# EAGLE design cloud_sensor (EAGLE 6.4)
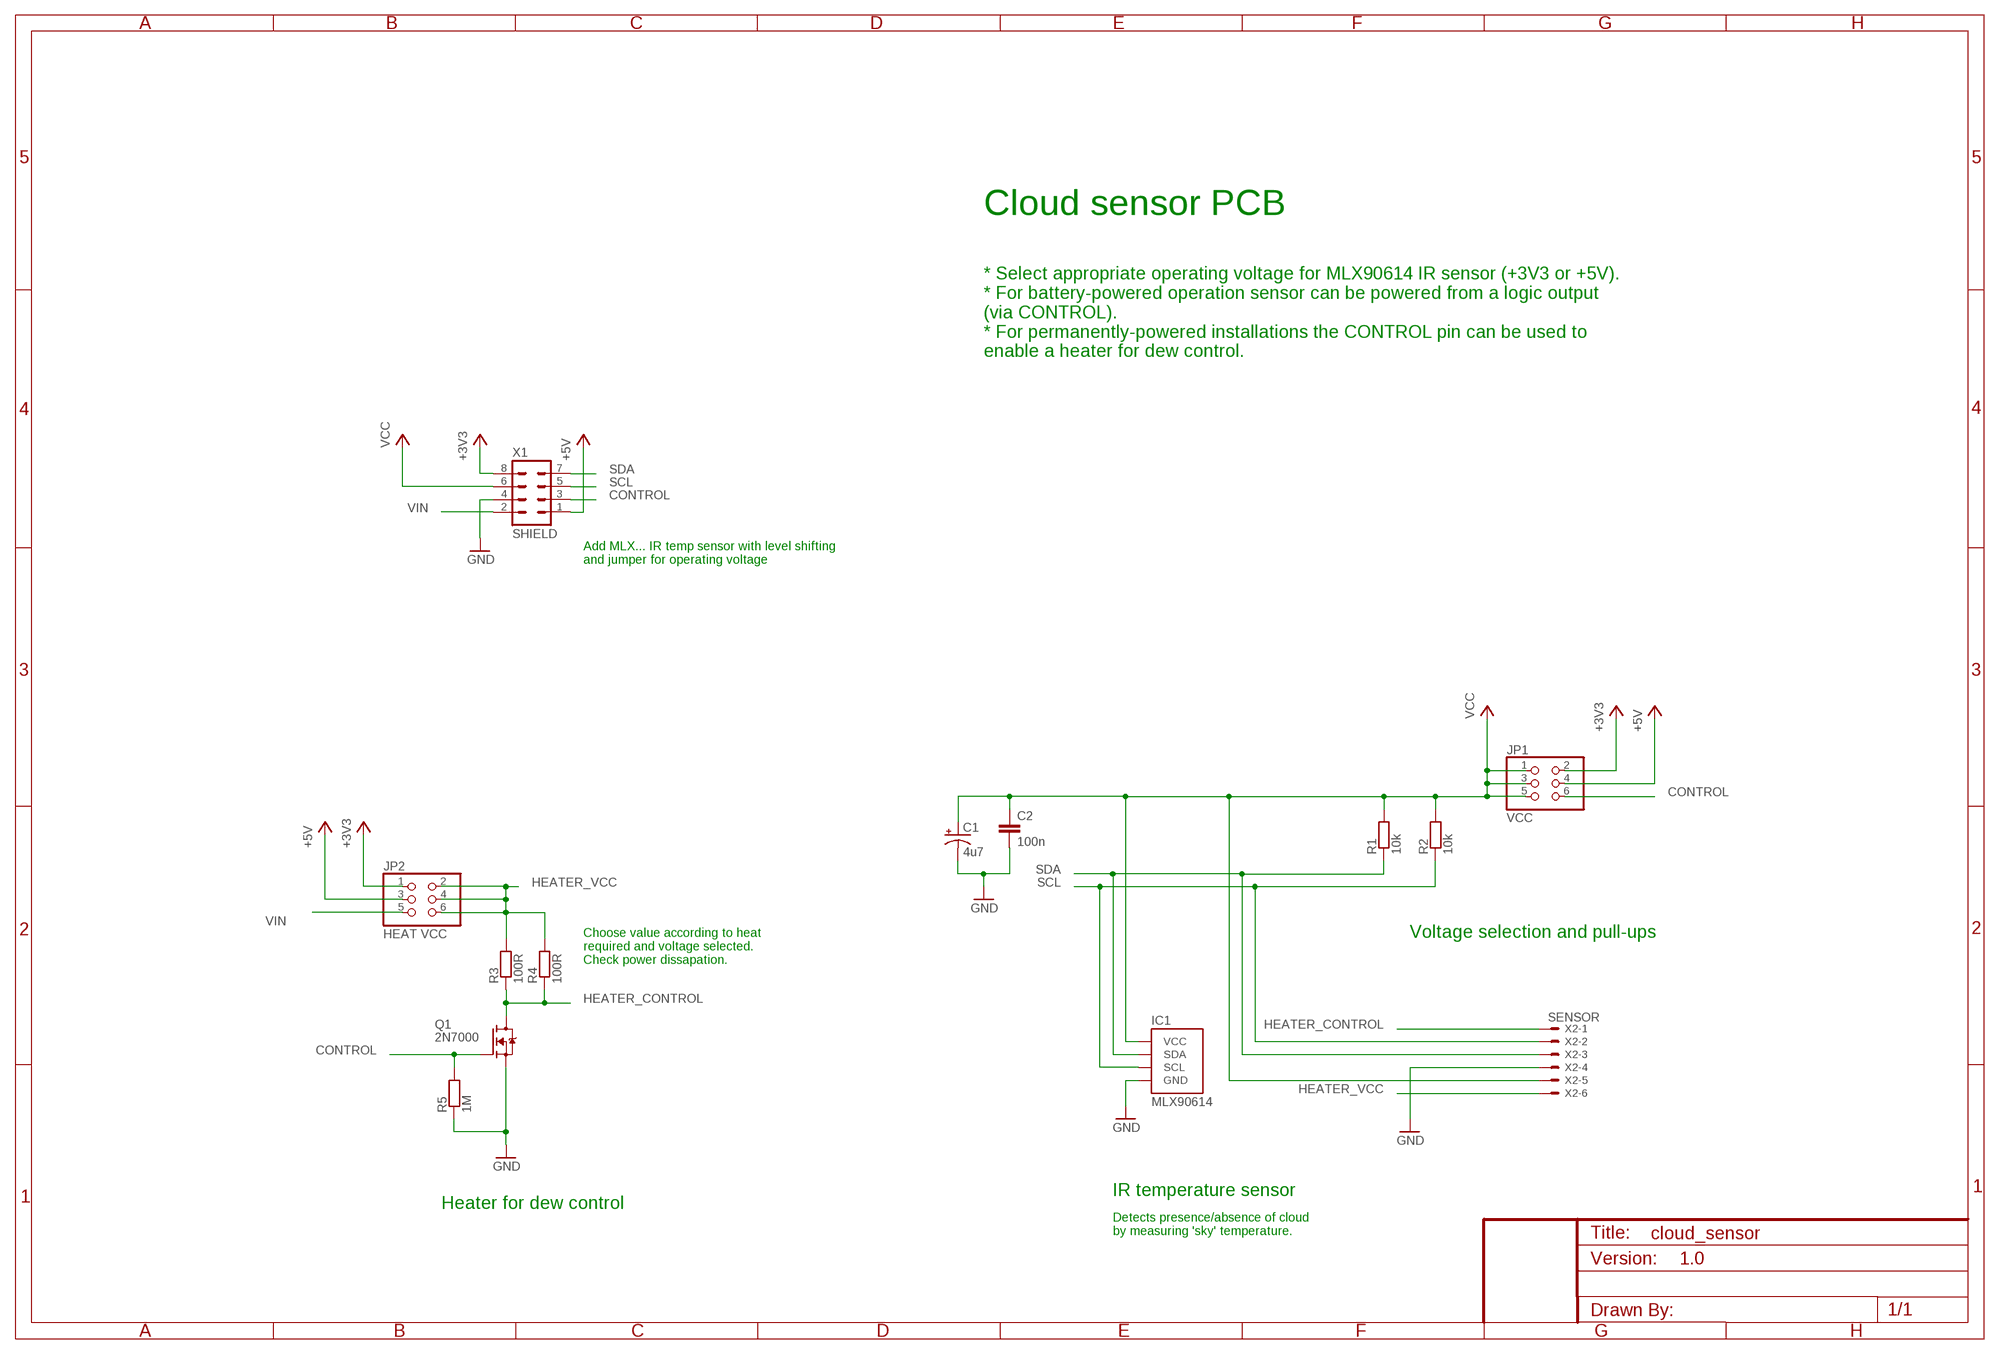
[diagram p0: schematic, sheet 1]

## Parts
C1  4u7  CAP_POLPTH2  [CPOL-RADIAL-10UF-25V]
C2  100n  CAPPTH  [CAP-PTH-SMALL]
IC1  MLX90614  MLX90614TO-39  [TO39-4]
JP1  VCC  PINHD-2X3  [2X03]
JP2  HEAT VCC  PINHD-2X3  [2X03]
Q1  2N7000  [TO-92]
R1  10k  RESISTOR  [RES-AXIAL-0.4]
R2  10k  RESISTOR  [RES-AXIAL-0.4]
R3  100R  RESISTOR  [RES-AXIAL-0.4]
R4  100R  RESISTOR  [RES-AXIAL-0.4]
R5  1M  RESISTOR  [RES-AXIAL-0.4]
X1  SHIELD  ML8  [ML8]
X2  SENSOR  22-23-2061  [22-23-2061]

## Nets
+3V3 [power]: JP1.2 JP2.1 X1.8
+5V [power]: JP1.4 JP2.3 X1.1
CONTROL: JP1.6 Q1.2(G) R5.P$2 X1.3
GND [power]: C1.2(-) C2.2 IC1.4(GND) Q1.1(S) R5.P$1 X1.4 X2.4
HEATER_CONTROL [power]: Q1.3(D) R3.P$1 R4.P$1 X2.1
HEATER_VCC [power]: JP2.2 JP2.4 JP2.6 R3.P$2 R4.P$2 X2.6
SCL: IC1.1(SCL) R2.P$1 X1.5 X2.2
SDA: IC1.2(SDA) R1.P$1 X1.7 X2.3
VCC [power]: C1.1(+) C2.1 IC1.3(VCC) JP1.1 JP1.3 JP1.5 R1.P$2 R2.P$2 X1.6 X2.5
VIN [power]: JP2.5 X1.2

## Notes on the sheet
- Cloud sensor PCB
- * Select appropriate operating voltage for MLX90614 IR sensor (+3V3 or +5V).
  * For battery-powered operation sensor can be powered from a logic output
  (via CONTROL).
  * For permanently-powered installations the CONTROL pin can be used to
  enable a heater for dew control.
- Add MLX... IR temp sensor with level shifting
  and jumper for operating voltage
- Voltage selection and pull-ups
- Choose value according to heat
  required and voltage selected.
  Check power dissapation.
- IR temperature sensor
- Heater for dew control
- Detects presence/absence of cloud
  by measuring 'sky' temperature.
- 1.0

## Library data of the parts
C1 = SteveMarple:CAP_POL: Capacitor Polarized These are standard SMD and PTH capacitors. Normally 10uF, 47uF, and 100uF in electrolytic and tantalum varieties. Always verify the external diameter of the through hole cap, it varies with capacity, voltage, and manufacturer. The EIA devices should be standard.
C2 = SparkFun:CAP: Capacitor Standard 0603 ceramic capacitor, and 0.1" leaded capacitor.
IC1 = SteveMarple:MLX90614
JP1 JP2 = pinhead:PINHD-2X3: PIN HEADER
Q1 = SteveMarple:2N7000: 2N7000 FET
R1-R5 = SteveMarple:RESISTOR: 1/4W PTH resistor
X1 = SteveMarple:ML8
X2 = con-molex:22-23-2061: .100" (2.54mm) Center Header - 6 Pin; MF: MOLEX; MPN: 22-23-2061; OC_FARNELL: 1462922; OC_NEWARK: 27C1933

## Net classes
1 power: width 0.381 mm

## Board
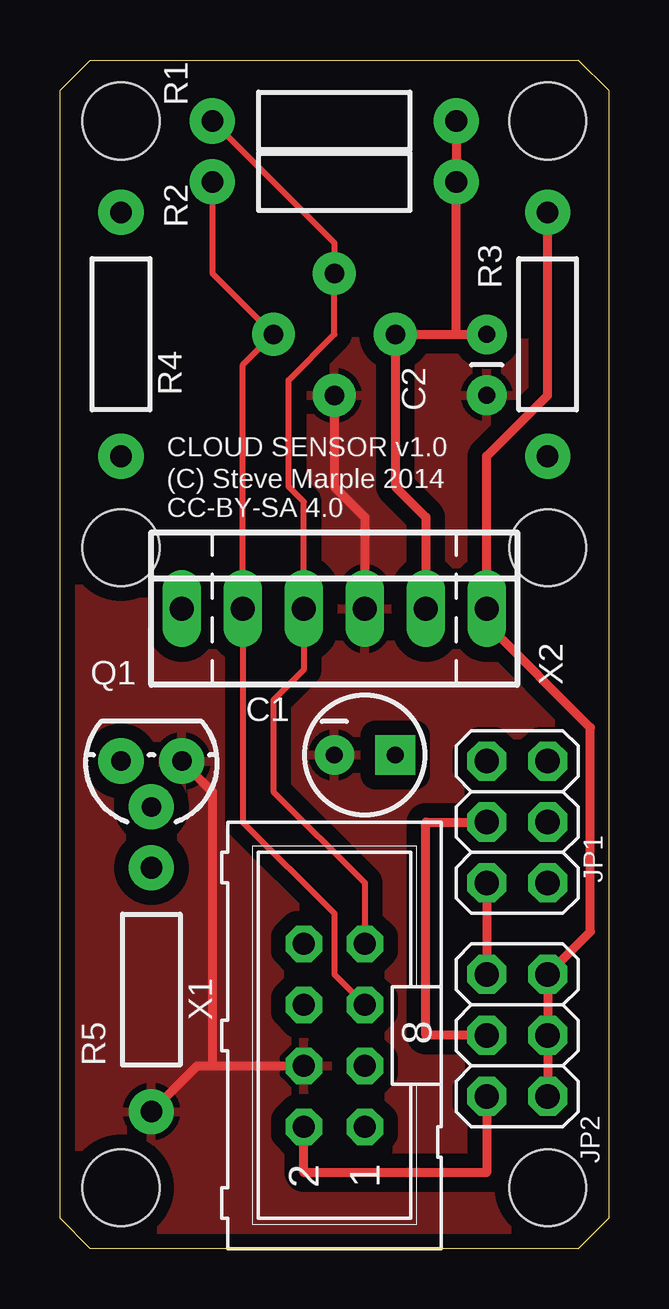
[diagram p1: board, top side]
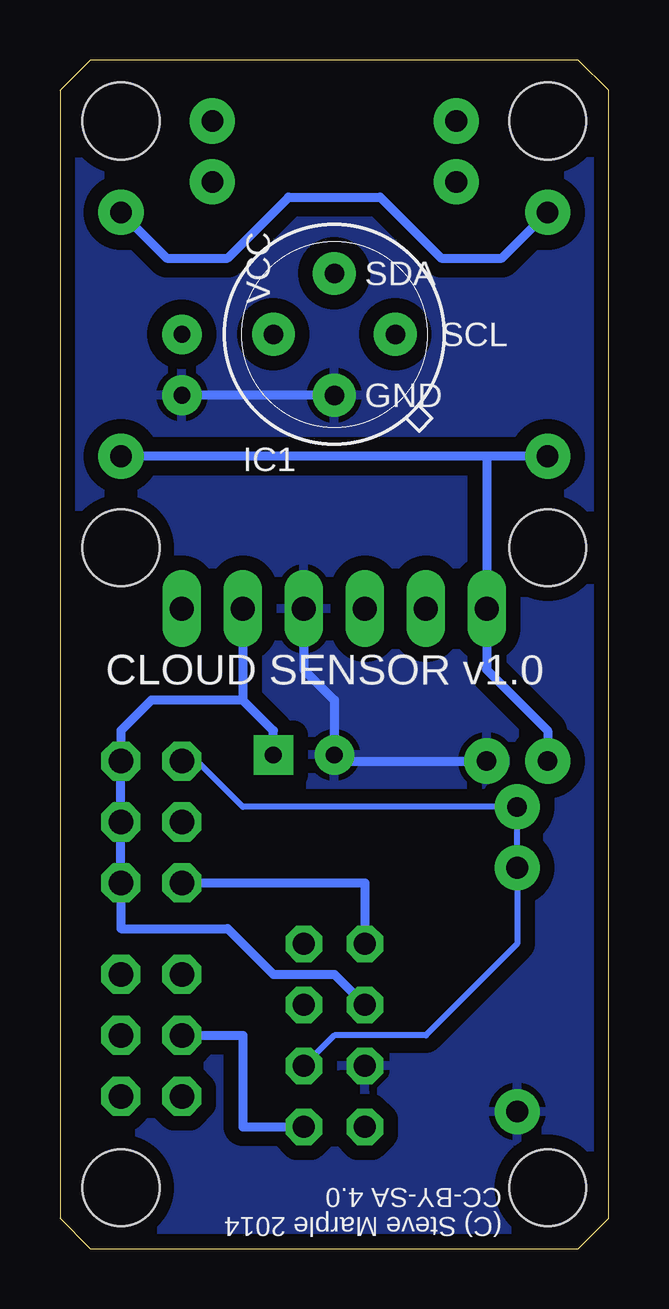
[diagram p2: board, bottom side, seen from below]

Size 22.86 x 49.53 mm. Coordinates in mm from the lower left corner, seen from the top.
Outline: 0,1.27 0,48.26 1.27,49.53 21.59,49.53 22.86,48.26 22.86,1.27 21.59,0 1.27,0 0,1.27
Copper layers (1*16): Top 0.035mm / dielectric 1.5mm / Bottom 0.035mm
Design rules "SparkFun_Iteadstudio_10mil": minimum track width 10mil, minimum drill 20mil, track to track 10mil, track to pad 10mil, pad to pad 10mil, via to via 10mil, smd to smd 10mil, copper to edge 0.5mm, drill to drill 8mil, minimum pad ring 12mil, minimum via ring 10mil, stop-mask expansion 4mil, vias tented up to drill 25mil, thermal gap 10mil
Holes 3.2 mm at 2.54,2.54 20.32,2.54 20.32,46.99 2.54,46.99 2.54,29.21 20.32,29.21

### Footprints (pad centres in the part's own frame; a part is rotated, then mirrored left to right if it is on the bottom)
CPOL-RADIAL-10UF-25V = drill 0.7 pad 1.651 square: 1 1.27,0 | drill 0.7 pad 1.651: 2 -1.27,0
CAP-PTH-SMALL = drill 0.7 pad 1.651: 1 0,0; 2 2.54,0
TO39-4 = drill 0.813 pad 1.778: 1 0,-2.54; 2 2.54,0; 3 0,2.54; 4 -2.54,0
2X03 = drill 1.016 octagon: 1 -2.54,-1.27; 2 -2.54,1.27; 3 0,-1.27; 4 0,1.27; 5 2.54,-1.27; 6 2.54,1.27
TO-92 = drill 0.813 pad 1.88: 1 -1.27,0; 2 0,1.905; 3 1.27,0
RES-AXIAL-0.4 = drill 0.9 pad 1.88: P$1 -5.08,0; P$2 5.08,0
ML8 = drill 0.914 octagon: 1 -3.81,-1.27; 2 -3.81,1.27; 3 -1.27,-1.27; 4 -1.27,1.27; 5 1.27,-1.27; 6 1.27,1.27; 7 3.81,-1.27; 8 3.81,1.27
22-23-2061 = drill 1 long: 1 -6.35,0; 2 -3.81,0; 3 -1.27,0; 4 1.27,0; 5 3.81,0; 6 6.35,0

### Placement (x,y rotation side)
C1  12.7,20.57 0 top
C2  17.78,38.1 270 top
IC1  11.43,38.1 90 bottom
JP1  19.05,17.78 90 top
JP2  19.05,8.89 270 top
Q1  3.81,20.32 180 top
R1  11.43,46.99 0 top
R2  11.43,44.45 0 top
R3  20.32,38.1 90 top
R4  2.54,38.1 90 top
R5  3.81,10.79 90 top
X1  11.43,8.89 90 top
X2  11.43,26.67 0 top

### Tracks (layer width: path | path; a pad name or v marks a point on that pad's centre or on a via)
+3V3
  Top 0.381: JP1.2 JP2.1
  Bottom 0.381: X1.8 10.16,15.24 JP1.2
+5V
  Top 0.381: JP1.4 15.24,17.78 15.24,8.89 JP2.3
  Bottom 0.381: X1.1 15.24,5.08 15.24,8.89 JP2.3
CONTROL
  Bottom 0.254: JP1.6 17.14,20.32 15.24,18.41 Q1.2 R5.P$2 3.81,12.7 7.62,8.89 11.43,8.89 X1.3
GND
  Top 0.381: R5.P$1 5.71,7.62 X1.4 6.35,7.62 6.35,19.05 Q1.1 | X2.4 12.7,30.48 11.43,31.75 IC1.4
  Bottom 0.381: IC1.4 C2.2 | X2.4 12.7,24.13 11.43,22.86 C1.2 11.43,20.32 Q1.1
  pour Bottom (isolate 0.61): -1.27,-1.27 -1.27,50.8 24.13,50.8 24.13,-1.27
  pour Top (isolate 0.61): -2.54,-2.54 -2.54,52.07 25.4,52.07 25.4,-2.54
HEATER_CONTROL
  Bottom 0.381: Q1.3 2.54,21.59 5.08,24.13 X2.1 5.08,33.02 | R4.P$1 5.08,33.02 | 5.08,33.02 R3.P$1
HEATER_VCC
  Top 0.381: JP2.6 JP2.4 JP2.2 22.1,13.21 22.1,21.72 17.78,26.04 X2.6 17.78,33.02 20.32,35.56 R3.P$2
  Bottom 0.381: R4.P$2 4.45,41.27 6.99,41.27 9.53,43.81 13.34,43.81 15.88,41.27 18.41,41.27 R3.P$2
SCL
  Top 0.254: R2.P$1 6.35,40.64 IC1.1 7.62,36.83 X2.2 7.62,17.78 11.43,13.97 11.43,11.43 X1.5
SDA
  Top 0.254: R1.P$1 11.43,41.91 IC1.2 11.43,38.1 9.53,36.2 9.53,31.75 10.16,31.11 X2.3 10.16,24.13 8.89,22.86 8.89,19.05 12.7,15.24 X1.7
VCC
  Top 0.381: R1.P$2 R2.P$2 16.51,38.1 | X2.5 15.24,30.48 13.97,31.75 IC1.3 16.51,38.1 | 16.51,38.1 C2.1
  Bottom 0.381: X1.6 11.43,11.43 13.97,11.43 15.88,13.34 20.32,13.34 JP1.1 JP1.3 JP1.5 20.32,21.59 19.05,22.86 15.24,22.86 | X2.5 15.24,22.86 | C1.1 13.97,21.59 15.24,22.86
VIN
  Top 0.381: X1.2 10.16,3.17 17.78,3.17 JP2.5 17.78,6.41

### Text on the board
_tsilk: CLOUD SENSOR v1.0 | (C) Steve Marple 2014 / CC-BY-SA 4.0
_bsilk: SDA | VCC | SCL | GND | CLOUD SENSOR v1.0 | (C) Steve Marple 2014 / CC-BY-SA 4.0